# EAGLE schematic v1 (EAGLE 7.3.0)
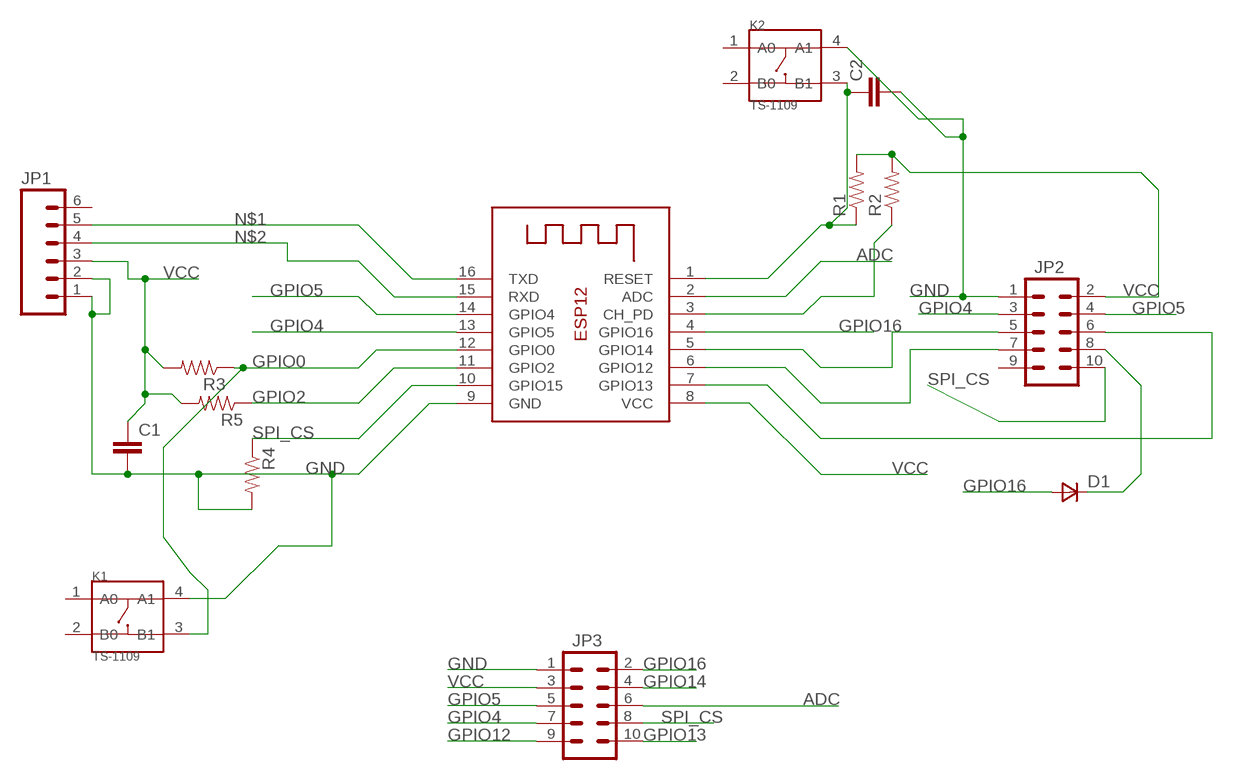
[diagram p0: schematic, sheet 1]

## Parts
C1  CAP0805  [0805]
C2  CAP0805  [0805]
D1  DSOD323  [SOD323]
JP1  M06SILK_FEMALE_PTH  [1X06]
JP2  M05X2PTH  [AVR_ICSP]
JP3  M05X2PTH  [AVR_ICSP]
K1  TS-1109  DIP-BUTTON-4P  [SW4-6.0X6.0X5.0MM]
K2  TS-1109  DIP-BUTTON-4P  [SW4-6.0X6.0X5.0MM]
R1  RESISTOR0805-RES  [0805]
R2  RESISTOR0805-RES  [0805]
R3  RESISTOR0805-RES  [0805]
R4  RESISTOR0805-RES  [0805]
R5  RESISTOR0805-RES  [0805]
X1  ESP-12  [ESP-12]

## Nets
ADC: JP3.6 X1.2(ADC)
GND: C1.2 C2.2 JP1.1 JP1.2 JP2.1 JP3.1 K1.4(A1) K2.4(A1) R4.2 X1.9(GND)
GPIO0: K1.3(B1) R3.1 X1.12(GPIO0)
GPIO2: R5.1 X1.11(GPIO2)
GPIO4: JP2.3 JP3.7 X1.13(GPIO5)
GPIO5: JP2.4 JP3.5 X1.14(GPIO4)
GPIO12: JP3.9
GPIO13: JP3.10
GPIO14: JP2.5 JP3.4 X1.5(GPIO14)
GPIO16: D1.2(A) JP3.2 X1.4(GPIO16)
N$1: JP1.5 X1.16(TXD)
N$2: JP1.4 X1.15(RXD)
N$5: JP2.7 X1.6(GPIO12)
N$6: JP2.6 X1.7(GPIO13)
N$9: D1.1(C) JP2.8
N$10: C2.1 K2.3(B1) R1.1 X1.1(RESET)
N$11: R2.1 X1.3(CH_PD)
SPI_CS: JP2.10 JP3.8 R4.1 X1.10(GPIO15)
VCC: C1.1 JP1.3 JP2.2 JP3.3 R1.2 R2.2 R3.2 R5.2 X1.8(VCC)
Unconnected: JP1.6 JP2.9 K1.1(A0) K1.2(B0) K2.1(A0) K2.2(B0)

## Library data of the parts
C1 C2 = SparkFun-Capacitors:CAP: Capacitor Standard 0603 ceramic capacitor, and 0.1" leaded capacitor.
D1 = zetex:D: DIODE; MPN: CDSOD323-T05C; OC_FARNELL: 1824860; OC_NEWARK: 79R6078
JP1 = SparkFun-Connectors:M06: Header 6 Standard 6-pin 0.1" header. Use with straight break away headers (SKU : PRT-00116), right angle break away headers (PRT-00553), swiss pins (PRT-00743), machine pins (PRT-00117), and female headers (PRT-00115). Molex polarized connector foot print use with SKU : PRT-08094 with associated crimp pins and housings. NOTES ON THE VARIANTS LOCK and LOCK_LONGPADS... This footprint was designed to help hold the alignment of a through-hole component (i.e. 6-pin header) while soldering it into place. You may notice that each hole has been shifted either up or down by 0.005 of an inch from it's more standard position (which is a perfectly straight line). This slight alteration caused the pins (the squares in the middle) to touch the edges of the holes. Because they are alternating, it causes a "brace" to hold the component in place. 0.005 has proven to be the perfect amount of "off-center" position when using our standard breakaway headers. Although looks a little odd when you look at the bare footprint, once you have a header in there, the alteration is very hard to notice. Also,if you push a header all the way into place, it is covered up entirely on the bottom side. This idea of altering the position of holes to aid alignment will be further integrated into the Sparkfun Library for other footprints. It can help hold any component with 3 or more connection pins.; PROD_ID: CONN-08437
JP2 JP3 = SparkFun-Connectors:M05X2: Header 5x2 Standard 10-pin dual row 0.1" header. Commonly used with AVR-ISP. Use with Spark Fun Electronics SKU: PRT-00778
K1 K2 = Seeed-OPL-Button:DIP-BUTTON-4P: 311020024
R1-R5 = SparkFun-Passives:RESISTOR: Resistor Basic schematic elements and footprints for 0603, 1206, and PTH resistors.
X1 = adafruit:ESP-12